# Altium schematic sheet NG2093_CAM_4Lane.SchDoc: =project_title
size Tabloid; PageSetup: Record=PageOptions|CenterHorizontal=True|CenterVertical=True|PrintScale=0.71|XCorrection=1.00|YCorrection=1.00|PrintKind=0|BorderSize=5000000|LeftOffset=0|BottomOffset=0|Orientation=2|PaperLength=1000|PaperWidth=1000|Scale=100|PaperSource=7|PrintQuality=-4|MediaType=1|DitherType=10|PrintScaleMode=1|PaperKind=A4; CompanyName: Luxonis Holding; Organization: Luxonis Holding; Address1: 1925 Harmony Park Drive; Address2: Westminster, CO; Address3: 80234; Address4: United States; SheetNumber: 13; SheetTotal: 15
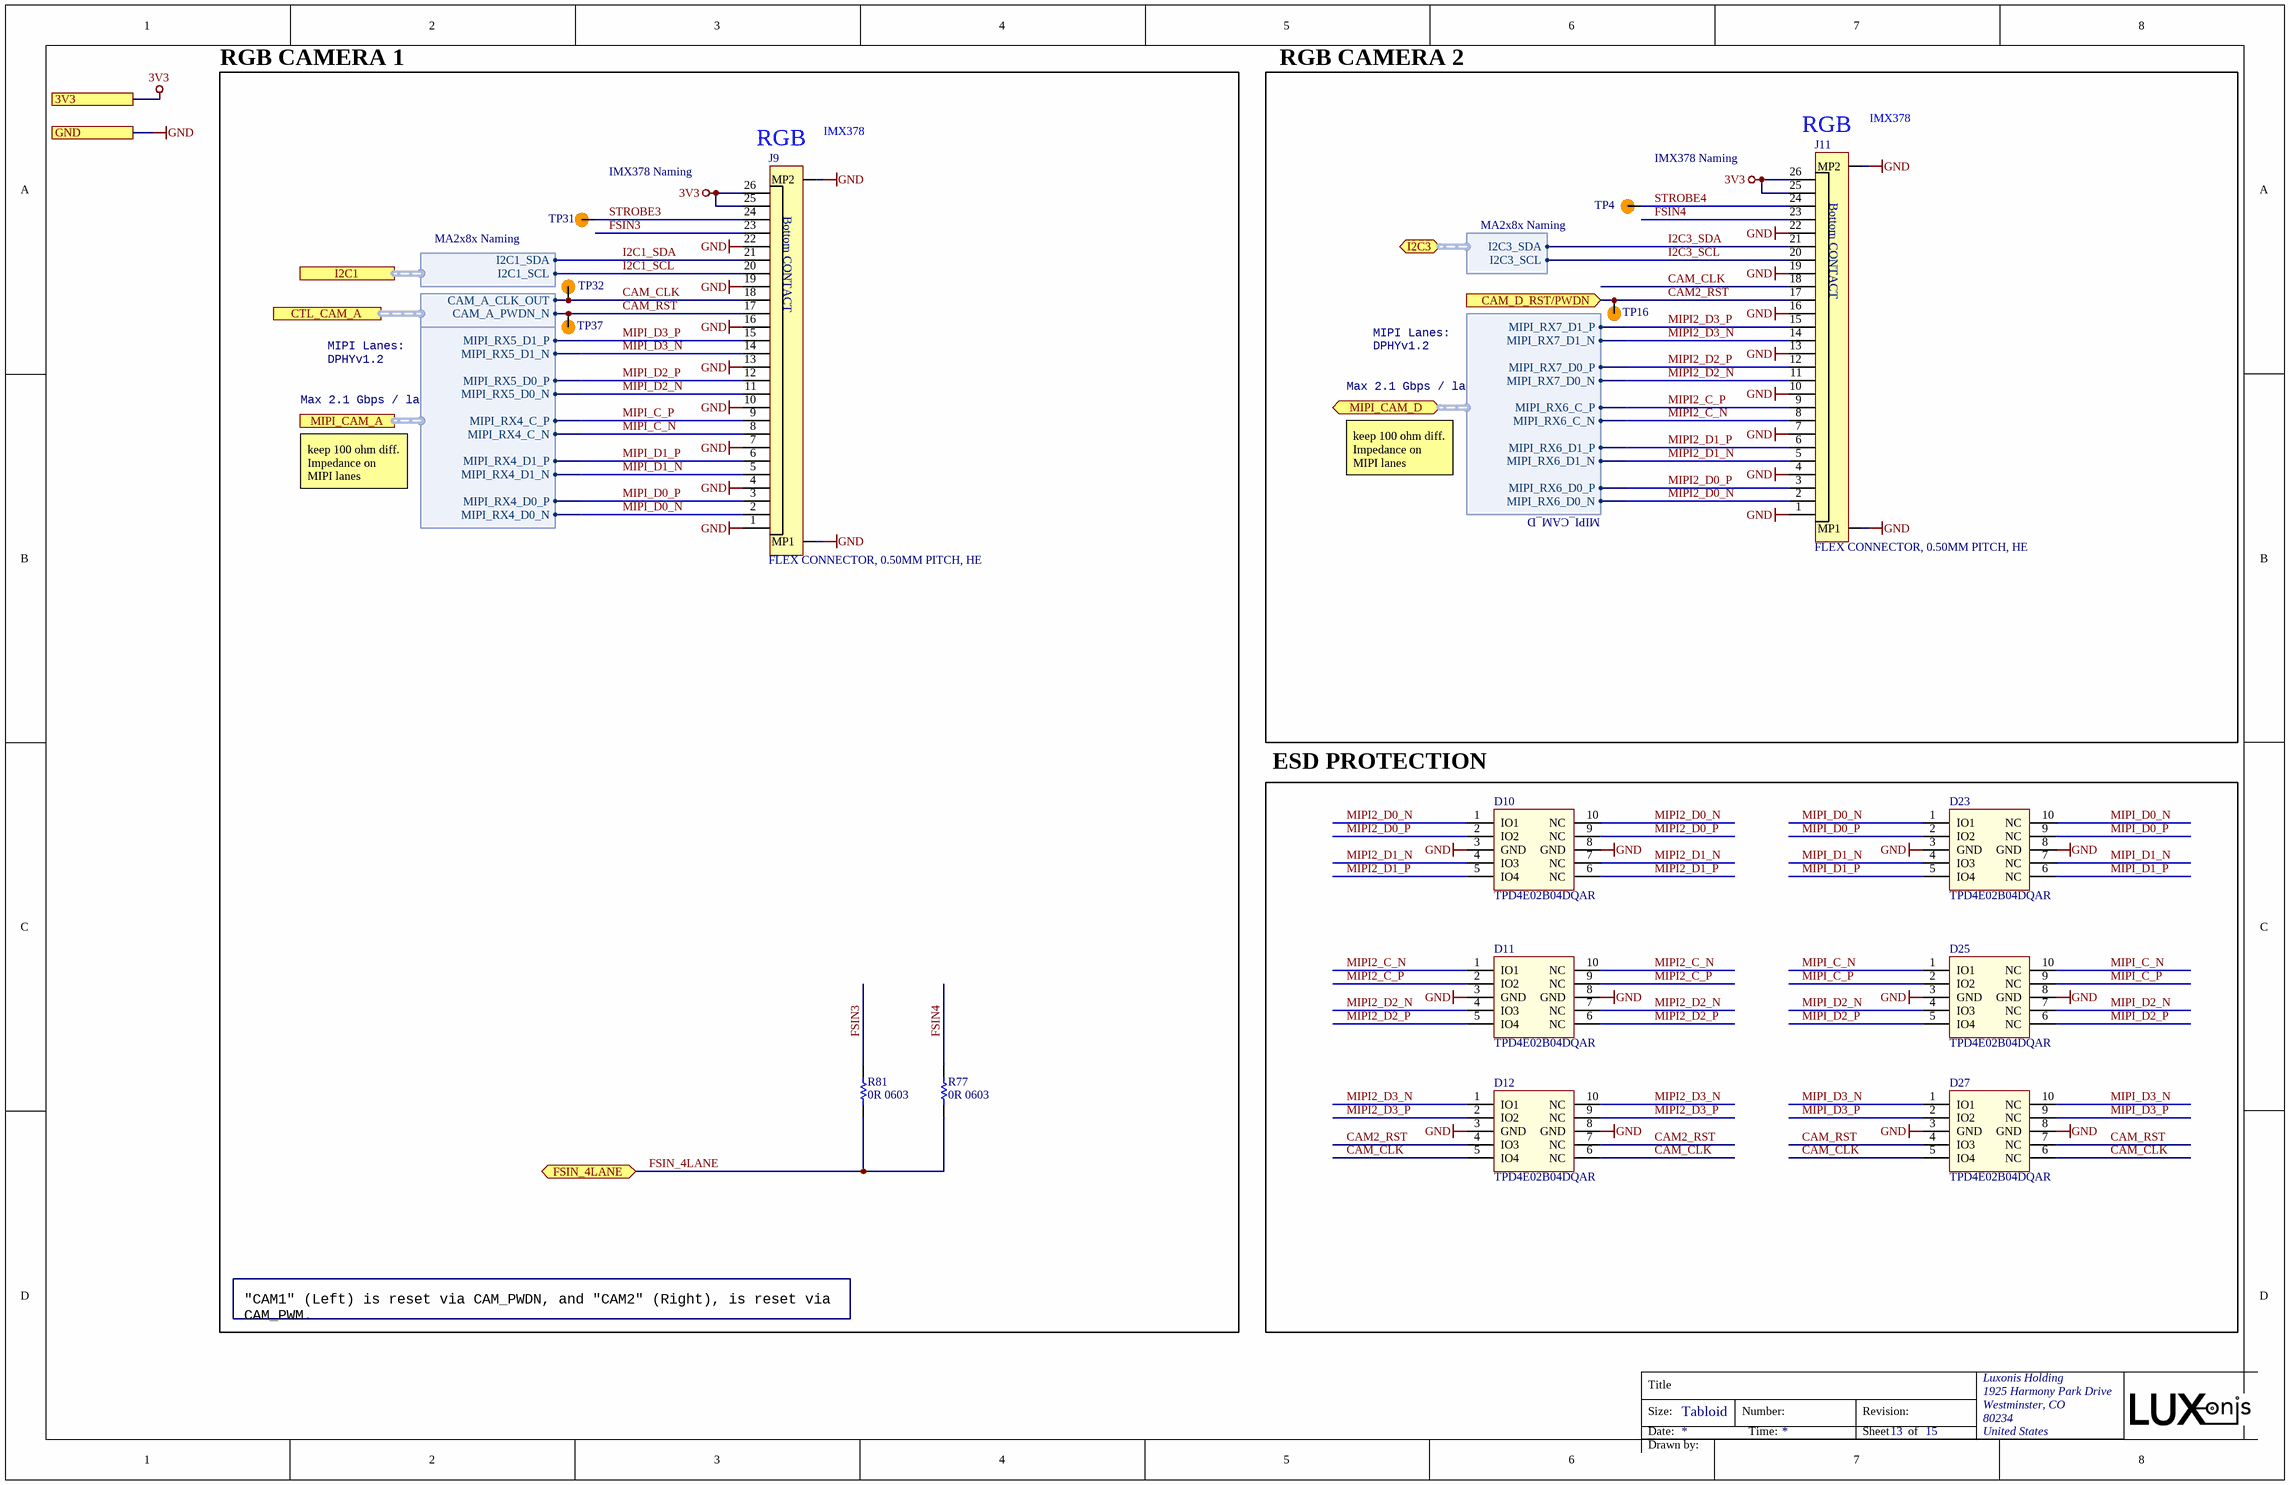
[diagram p0: NG2093_CAM_4Lane.SchDoc]

## Parts
D10  TPD4E02B04DQAR  [TPD4E02B04DQAR]
D11  TPD4E02B04DQAR  [TPD4E02B04DQAR]
D12  TPD4E02B04DQAR  [TPD4E02B04DQAR]
D23  TPD4E02B04DQAR  [TPD4E02B04DQAR]
D25  TPD4E02B04DQAR  [TPD4E02B04DQAR]
D27  TPD4E02B04DQAR  [TPD4E02B04DQAR]
J9  FLEX CONNECTOR, 0.50MM PITCH, HE  [F32R-1A7H1-11026]
J11  FLEX CONNECTOR, 0.50MM PITCH, HE  [F32R-1A7H1-11026]
R77  0R 0603  [RESC0603(1608)_N]
R81  0R 0603  [RESC0603(1608)_N]
TP4  TP100_200_NS  [TP100_200_NS]  (value not drawn)  (no BOM)
TP16  TP100_200_NS  [TP100_200_NS]  (value not drawn)  (no BOM)
TP31  TP100_200_NS  [TP100_200_NS]  (value not drawn)  (no BOM)
TP32  TP100_200_NS  [TP100_200_NS]  (value not drawn)  (no BOM)
TP37  TP100_200_NS  [TP100_200_NS]  (value not drawn)  (no BOM)

## Blocks framed on the sheet
ESD PROTECTION: D10-D12 D23 D25 D27

## Ports
3V3, CAM_D_RST/PWDN (in), CTL_CAM_A (harness CTL_CAM_A), FSIN_4LANE (bidir), GND, I2C1 (harness I2C1), I2C3 (bidir, harness I2C3), MIPI_CAM_A (harness MIPI_CAM_A), MIPI_CAM_D (bidir, harness MIPI_CAM_D)

## Harnesses
I2C1: I2C1_SDA, I2C1_SCL
MIPI_CAM_A: MIPI_RX5_D0_P, MIPI_RX5_D0_N, MIPI_RX4_D0_P, MIPI_RX4_D0_N, MIPI_RX4_C_P, MIPI_RX4_C_N, MIPI_RX4_D1_N, MIPI_RX4_D1_P, MIPI_RX5_D1_P, MIPI_RX5_D1_N
CTL_CAM_A: CAM_A_PWDN_N, CAM_A_CLK_OUT
MIPI_CAM_D: MIPI_RX6_C_N, MIPI_RX6_C_P, MIPI_RX6_D0_N, MIPI_RX6_D0_P, MIPI_RX6_D1_N, MIPI_RX6_D1_P, MIPI_RX7_D0_N, MIPI_RX7_D0_P, MIPI_RX7_D1_N, MIPI_RX7_D1_P
I2C3: I2C3_SCL, I2C3_SDA

## Nets
3V3: J9.25 J9.26 J11.25 J11.26 ; port 3V3
GND: D10.3(GND) D10.8(GND) D11.3(GND) D11.8(GND) D12.3(GND) D12.8(GND) D23.3(GND) D23.8(GND) D25.3(GND) D25.8(GND) D27.3(GND) D27.8(GND) J9.1 J9.4 J9.7 J9.10 J9.13 J9.16 J9.19 J9.22 J9.MP1 J9.MP2 J11.1 J11.4 J11.7 J11.10 J11.13 J11.16 J11.19 J11.22 J11.MP1 J11.MP2 ; port GND
CAM2_RST: D12.4(IO3) D12.7(NC) J11.17 TP16.1 ; port CAM_D_RST/PWDN
CAM_CLK: D12.5(IO4) D12.6(NC) D27.5(IO4) D27.6(NC) J9.18 J11.18 TP32.1 ; port CTL_CAM_A.CAM_A_CLK_OUT
CAM_RST: D27.4(IO3) D27.7(NC) J9.17 TP37.1 ; port CTL_CAM_A.CAM_A_PWDN_N
FSIN3: J9.23 R81.2
FSIN4: J11.23 R77.2
FSIN_4LANE: R77.1 R81.1 ; port FSIN_4LANE
I2C1_SCL: J9.20 ; port I2C1.I2C1_SCL
I2C1_SDA: J9.21 ; port I2C1.I2C1_SDA
I2C3_SCL: J11.20 ; port I2C3.I2C3_SCL
I2C3_SDA: J11.21 ; port I2C3.I2C3_SDA
MIPI2_C_N: D11.1(IO1) D11.10(NC) J11.8 ; port MIPI_CAM_D.MIPI_RX6_C_N
MIPI2_C_P: D11.2(IO2) D11.9(NC) J11.9 ; port MIPI_CAM_D.MIPI_RX6_C_P
MIPI2_D0_N: D10.1(IO1) D10.10(NC) J11.2 ; port MIPI_CAM_D.MIPI_RX6_D0_N
MIPI2_D0_P: D10.2(IO2) D10.9(NC) J11.3 ; port MIPI_CAM_D.MIPI_RX6_D0_P
MIPI2_D1_N: D10.4(IO3) D10.7(NC) J11.5 ; port MIPI_CAM_D.MIPI_RX6_D1_N
MIPI2_D1_P: D10.5(IO4) D10.6(NC) J11.6 ; port MIPI_CAM_D.MIPI_RX6_D1_P
MIPI2_D2_N: D11.4(IO3) D11.7(NC) J11.11 ; port MIPI_CAM_D.MIPI_RX7_D0_N
MIPI2_D2_P: D11.5(IO4) D11.6(NC) J11.12 ; port MIPI_CAM_D.MIPI_RX7_D0_P
MIPI2_D3_N: D12.1(IO1) D12.10(NC) J11.14 ; port MIPI_CAM_D.MIPI_RX7_D1_N
MIPI2_D3_P: D12.2(IO2) D12.9(NC) J11.15 ; port MIPI_CAM_D.MIPI_RX7_D1_P
MIPI_C_N: D25.1(IO1) D25.10(NC) J9.8 ; port MIPI_CAM_A.MIPI_RX4_C_N
MIPI_C_P: D25.2(IO2) D25.9(NC) J9.9 ; port MIPI_CAM_A.MIPI_RX4_C_P
MIPI_D0_N: D23.1(IO1) D23.10(NC) J9.2 ; port MIPI_CAM_A.MIPI_RX4_D0_N
MIPI_D0_P: D23.2(IO2) D23.9(NC) J9.3 ; port MIPI_CAM_A.MIPI_RX4_D0_P
MIPI_D1_N: D23.4(IO3) D23.7(NC) J9.5 ; port MIPI_CAM_A.MIPI_RX4_D1_N
MIPI_D1_P: D23.5(IO4) D23.6(NC) J9.6 ; port MIPI_CAM_A.MIPI_RX4_D1_P
MIPI_D2_N: D25.4(IO3) D25.7(NC) J9.11 ; port MIPI_CAM_A.MIPI_RX5_D0_N
MIPI_D2_P: D25.5(IO4) D25.6(NC) J9.12 ; port MIPI_CAM_A.MIPI_RX5_D0_P
MIPI_D3_N: D27.1(IO1) D27.10(NC) J9.14 ; port MIPI_CAM_A.MIPI_RX5_D1_N
MIPI_D3_P: D27.2(IO2) D27.9(NC) J9.15 ; port MIPI_CAM_A.MIPI_RX5_D1_P
STROBE3: J9.24 TP31.1
STROBE4: J11.24 TP4.1

## Notes on the sheet
- RGB CAMERA 1
- RGB CAMERA 2
- (near J9) RGB
- (near J9) IMX378
- (near TP4) IMX378 Naming
- (near J11) RGB
- (near J11) IMX378
- (near TP31) IMX378 Naming
- MA2x8x Naming
- MIPI Lanes:
- DPHYv1.2
- Max 2.1 Gbps / lane
- keep 100 ohm diff. Impedance on MIPI lanes
- "CAM1" (Left) is reset via CAM_PWDN, and "CAM2" (Right), is reset via CAM_PWM.
- Title
- Size:
- Date:
- Tabloid
- Number:
- Time:
- Revision:
- Sheet
- of
- Drawn by:
- (in symbol F32R-1A7H1-11026) Bottom CONTACT

## Library data of the parts
D10-D12 D23 D25 D27 = TPD4E02B04DQAR: TVS DIODE 3.6V 8.8V 10USON 8.8V (Typ) Clamp 5A (8/20µs) Ipp Tvs Diode Surface Mount 10-USON (2.5x1); Manufacturer 1: Texas Instruments; Number of Bidirectional Channels: 4; Min Breakdown Voltage: 5.5V; Peak Pulse Power: 17W; Power Line Protection: No; Interface: USB,HDMI; Supplier 1: Digi-Key; Manufacturer Part Number 1: TPD4E02B04DQAR; Stock 1: 25615; Pricing 1: 1=0.69000, 10=0.60800, 100=0.46650, 500=0.36874, 1000=0.29499 (USD); RoHS: Yes; Mount: Surface Mount; Number of Pins: 10; Min Operating Temperature: -40°C; Max Operating Temperature: 125°C; Packaging: Cut Tape; Reverse Standoff Voltage: 3.6V; Clamping Voltage: 8.8V; Operating Supply Voltage: 3.6V; Peak Pulse Current: 5A; Number of Channels: 4; Composition: Zener; REACH SVHC: No SVHC; Lead Free: Lead Free; ComponentLink1URL: http://www.ti.com/general/docs/lit/getliterature.tsp?genericPartNumber=TPD4E02B04&amp;&amp;fileType=pdf&src-supplier=Element14; ComponentLink1Description: http://www.ti.com/general/docs/lit/getliterature.tsp?genericPartNumber=TPD4E02B04&amp;&amp;fileType=pdf&src-supplier=Element14; ComponentLink2URL: http://www.ti.com/lit/ds/symlink/tpd4e02b04.pdf?src-supplier=Farnell; ComponentLink2Description: http://www.ti.com/lit/ds/symlink/tpd4e02b04.pdf?src-supplier=Farnell; ComponentLink3URL: http://www.ti.com/lit/ds/symlink/tpd4e02b04.pdf?src-supplier=Newark; ComponentLink3Description: http://www.ti.com/lit/ds/symlink/tpd4e02b04.pdf?src-supplier=Newark; ComponentLink4URL: http://www.ti.com/lit/ds/symlink/tpd4e02b04.pdf?src-supplier=Digi-Key; ComponentLink4Description: http://www.ti.com/lit/ds/symlink/tpd4e02b04.pdf?src-supplier=Digi-Key; Supplier Part Number 1: 296-43875-1-ND
J9 J11 = F32R-1A7H1-11026: 26 Position FFC, FPC Connector Contacts, Bottom 0.020" (0.50mm) Surface Mount, Right Angle; Manufacturer 1: Amphenol ICC (FCI); Number of Positions: 26; Voltage Rating: 50V; Current Rating: 500mA; Pitch: 0.02inch; Supplier 1: Digi-Key; Manufacturer Part Number 1: F32R-1A7H1-11026; RoHS: Yes; Category: Connectors; Pricing 1: 1=0.77, 10=0.721, 100=0.5529, 500=0.4808 (USD); Mount: Surface Mount; Contact Plating: Tin; Contact Material: Bronze; Min Operating Temperature: -40°C; Max Operating Temperature: 105°C; Packaging: Tape and Reel; Termination: Solder; Flammability Rating: UL94 V-0; ComponentLink1URL: https://cdn.amphenol-icc.com/media/wysiwyg/files/drawing/f32r-f32j.pdf; ComponentLink1Description: https://cdn.amphenol-icc.com/media/wysiwyg/files/drawing/f32r-f32j.pdf; Stock 1: 1709; Supplier Part Number 1: 609-F32R-1A7H1-11026CT-ND
R77 R81 = CRCW06030000Z0EA: RES SMD 0 OHM JUMPER 1/10W 0603 0 Ohms Jumper 0.1W, 1/10W Chip Resistor 0603 (1608 Metric) Automotive AEC-Q200 Thick Film; Manufacturer 1: Vishay; Manufacturer Part Number 1: CRCW0603-0000Z0EA; Resistance: 0mR; Power Rating: 100mW; Voltage Rating: 75V; Temperature Coefficient: 100ppm/°C; Tolerance: 5%; Current Rating: 2A; Supplier 1: Digi-Key; Stock 1: 742743; Pricing 1: 1=0.100000, 10=0.034000, 25=0.024400, 50=0.018600, 100=0.013800, 250=0.010480, 500=0.008400, 1000=0.006180 (USD); RoHS: Yes; Mount: Surface Mount; Case/Package: 0603; Weight: 7.1E-05oz; Contact Plating: Tin,Lead; Case Code (Metric): 1608; Case Code (Imperial): 0603; Min Operating Temperature: -55°C; Max Operating Temperature: 155°C; Composition: Thick Film; Termination: SMD/SMT; Packaging: Tape and Reel; Package Quantity: 1; Number of Terminations: 2; Military Standard: Not; Max Power Dissipation: 100mW; Voltage Rating (DC): 75V; Features: Automotive AEC-Q200; Working Voltage: 75V; Length: 1.55mm; Height: 0.02inch; Width: 0.033inch; Depth: 0.85mm; Radiation Hardening: No; Lead Free: Lead Free; REACH SVHC: Unknown; ComponentLink1URL: https://datasheet.ciiva.com/2461/dcrcwe3-2461968.pdf?src-supplier=Digi-Key; ComponentLink1Description: https://datasheet.ciiva.com/2461/dcrcwe3-2461968.pdf?src-supplier=Digi-Key; ComponentLink2URL: https://datasheet.ciiva.com/2461/dcrcwe3-2461969.pdf?src-supplier=Digi-Key; ComponentLink2Description: https://datasheet.ciiva.com/2461/dcrcwe3-2461969.pdf?src-supplier=Digi-Key; ComponentLink3URL: https://datasheet.ciiva.com/2461/dcrcwe3-2461970.pdf?src-supplier=Digi-Key; ComponentLink3Description: https://datasheet.ciiva.com/2461/dcrcwe3-2461970.pdf?src-supplier=Digi-Key; ComponentLink4URL: https://datasheet.ciiva.com/8340/dcrcwe3-8340197.pdf?src-supplier=Avnet; ComponentLink4Description: https://datasheet.ciiva.com/8340/dcrcwe3-8340197.pdf?src-supplier=Avnet; ComponentLink5URL: https://datasheet.ciiva.com/16941/dcrcw-16941302.pdf?src-supplier=Avnet+Europe; ComponentLink5Description: https://datasheet.ciiva.com/16941/dcrcw-16941302.pdf?src-supplier=Avnet+Europe; ComponentLink6URL: https://datasheet.ciiva.com/16199/dcrcwe3-16199063.pdf?src-supplier=Future+Electronics; ComponentLink6Description: https://datasheet.ciiva.com/16199/dcrcwe3-16199063.pdf?src-supplier=Future+Electronics; ComponentLink7URL: https://datasheet.ciiva.com/16725/70201119-16725175.pdf?src-supplier=Allied+Electronics; ComponentLink7Description: https://datasheet.ciiva.com/16725/70201119-16725175.pdf?src-supplier=Allied+Electronics; ComponentLink8URL: https://datasheet.ciiva.com/26316/fld-crcw-e3-data-en-26316615.pdf?src-supplier=Distrelec; ComponentLink8Description: https://datasheet.ciiva.com/26316/fld-crcw-e3-data-en-26316615.pdf?src-supplier=Distrelec; ComponentLink9URL: https://datasheet.ciiva.com/5544/dcrcwe3-109170-5544344.pdf?src-supplier=Mouser; ComponentLink9Description: https://datasheet.ciiva.com/5544/dcrcwe3-109170-5544344.pdf?src-supplier=Mouser; ComponentLink10URL: https://datasheet.ciiva.com/7841/1720486-7841816.pdf?src-supplier=Element14; ComponentLink10Description: https://datasheet.ciiva.com/7841/1720486-7841816.pdf?src-supplier=Element14; ComponentLink11URL: https://datasheet.ciiva.com/7841/1720486-7841817.pdf?src-supplier=Element14; ComponentLink11Description: https://datasheet.ciiva.com/7841/1720486-7841817.pdf?src-supplier=Element14; ComponentLink12URL: https://datasheet.ciiva.com/7841/125364-7841818.pdf?src-supplier=Element14; ComponentLink12Description: https://datasheet.ciiva.com/7841/125364-7841818.pdf?src-supplier=Element14; ComponentLink13URL: https://datasheet.ciiva.com/16721/70201119-16721450.pdf?src-supplier=Allied+Electronics; ComponentLink13Description: https://datasheet.ciiva.com/16721/70201119-16721450.pdf?src-supplier=Allied+Electronics; Supplier Part Number 1: 541-0.0GCT-ND
TP4 TP16 TP31 TP32 TP37 = TEST_POINT